# EAGLE design untitled (EAGLE 9.6.2)
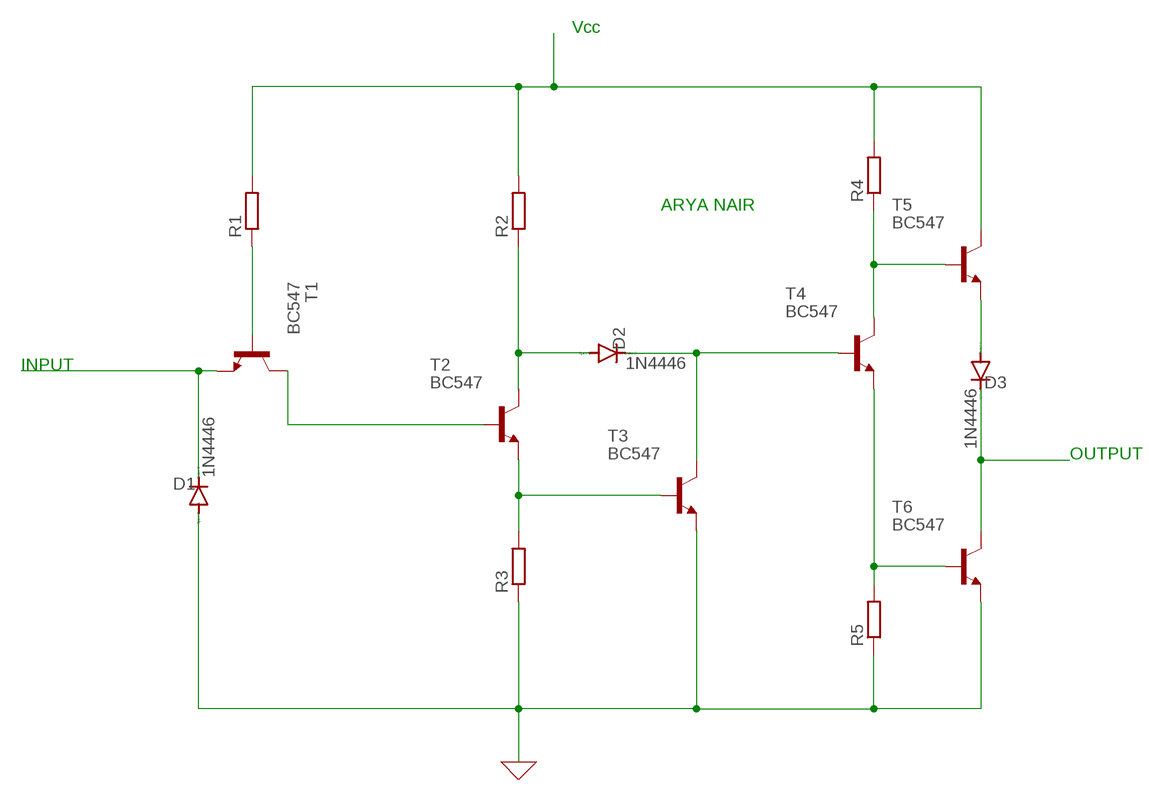
[diagram p0: schematic, sheet 1]

## Parts
D1  1N4446  [DO35-10]
D2  1N4446  [DO35-10]
D3  1N4446  [DO35-10]
R1  R-EU_0204/2V  [0204V]
R2  R-EU_0204/2V  [0204V]
R3  R-EU_0204/2V  [0204V]
R4  R-EU_0204/2V  [0204V]
R5  R-EU_0204/2V  [0204V]
T1  BC547  [TO92]
T2  BC547  [TO92]
T3  BC547  [TO92]
T4  BC547  [TO92]
T5  BC547  [TO92]
T6  BC547  [TO92]

## Nets
0: D1.A R3.1 R5.1 T3.1(E) T6.1(E) ; supply symbol labelled GND
N$1: T1.3(C) T2.2(B)
N$2: R3.2 T2.1(E) T3.2(B)
N$3: D2.A R2.1 T2.3(C)
N$4: R1.2 R2.2 R4.2 T5.3(C)
N$5: R1.1 T1.2(B)
N$7: D1.C T1.1(E)
N$8: D2.C T3.3(C) T4.2(B)
N$10: R4.1 T4.3(C) T5.2(B)
N$11: D3.A T5.1(E)
N$12: R5.2 T4.1(E) T6.2(B)
N$13: D3.C T6.3(C)

## Notes on the sheet
- Vcc
- ARYA NAIR
- INPUT
- OUTPUT

## Library data of the parts
D1-D3 = diode:1N4446: DIODE high speed (Philips)
R1-R5 = rcl:R-EU_: RESISTOR, European symbol; SPICEPREFIX: R
T1-T6 = transistor:BC547: NPN TRANSISTOR

## Board
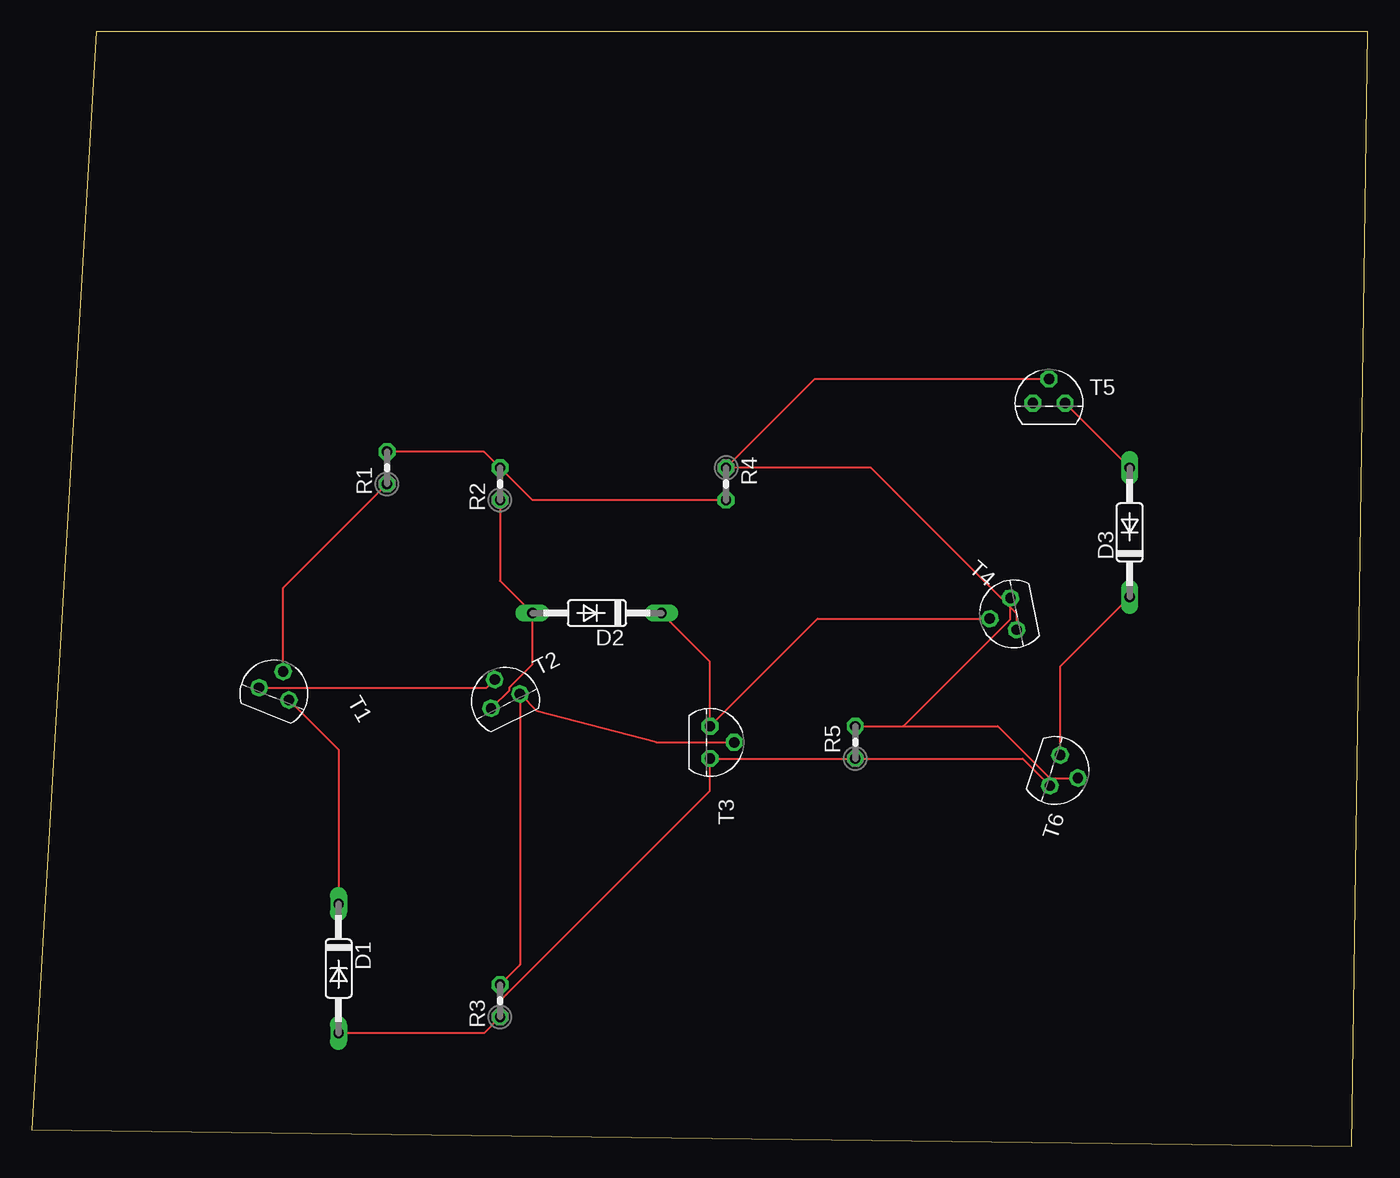
[diagram p1: board, top side]
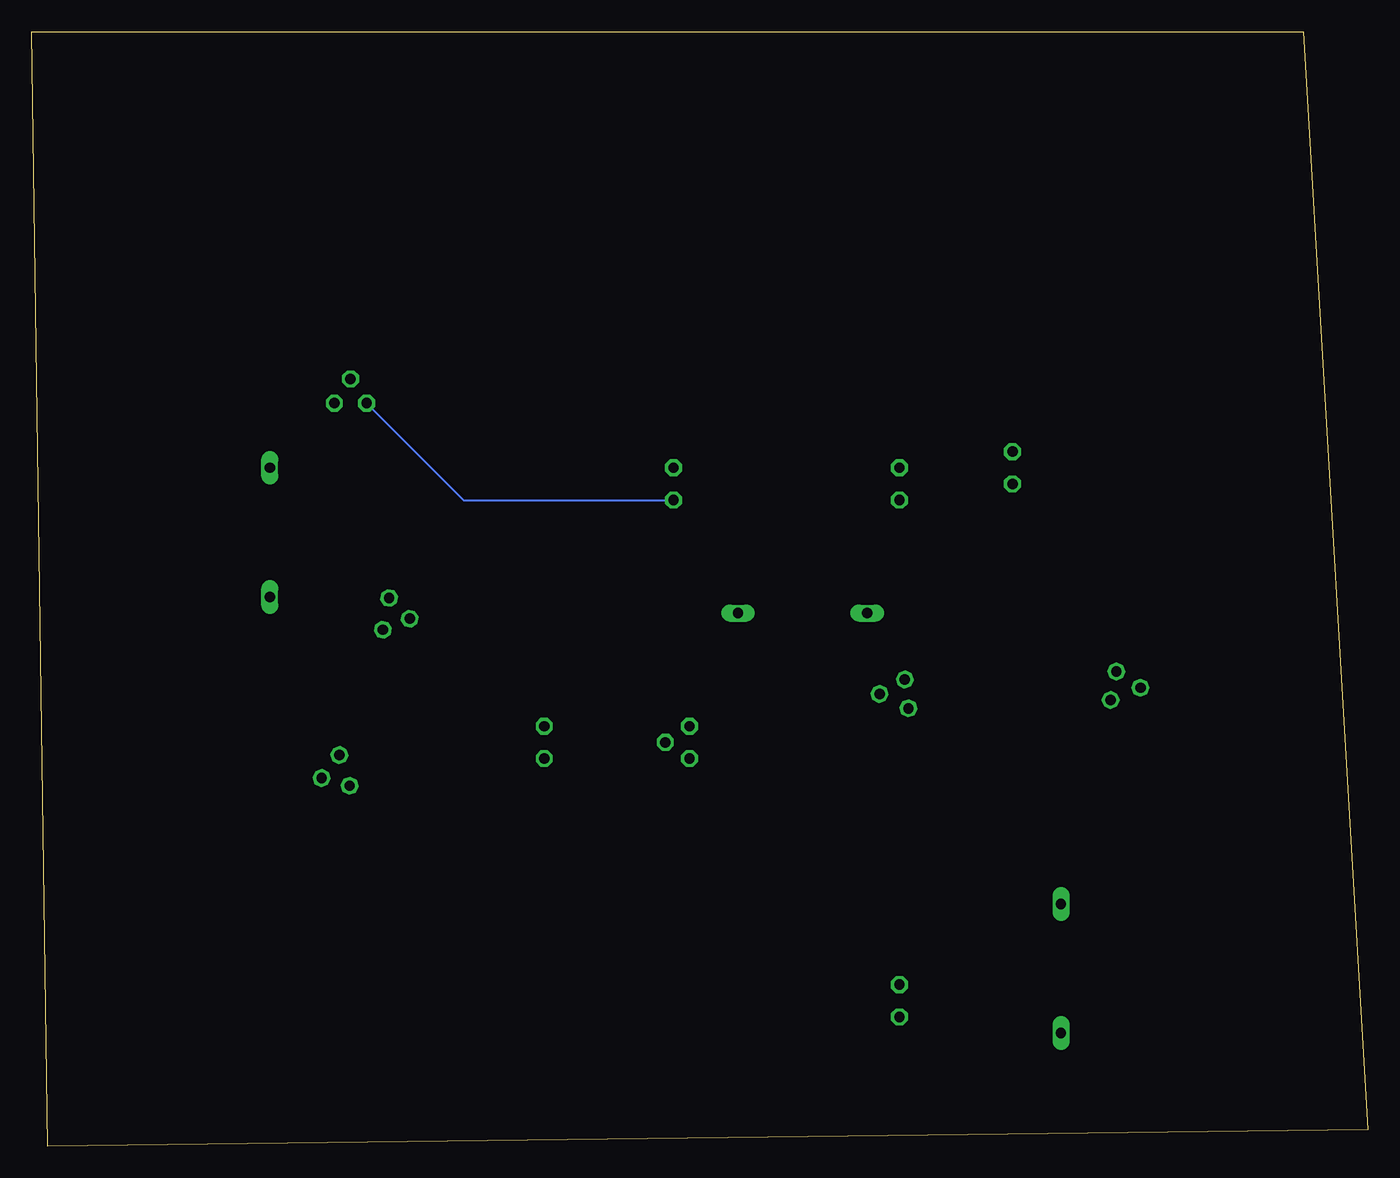
[diagram p2: board, bottom side, seen from below]

Size 105.08 x 87.62 mm. Coordinates in mm from the lower left corner, seen from the top.
Outline: 0,1.27 103.81,0 105.08,87.62 5.08,87.62 0,1.27
Copper layers (1*16): Top 0.035mm / dielectric 1.5mm / Bottom 0.035mm
Design rules "default": minimum track width 6mil, minimum drill 0.35mm, track to track 6mil, track to pad 6mil, pad to pad 6mil, via to via 6mil, smd to smd 6mil, copper to edge 40mil, drill to drill 6mil, minimum pad ring 10mil, minimum via ring 8mil, stop-mask expansion 4mil, vias tented up to drill 0mil, thermal gap 10mil

### Footprints (pad centres in the part's own frame; a part is rotated, then mirrored left to right if it is on the bottom)
DO35-10 = drill 0.813 long: A 5.08,0; C -5.08,0
0204V = drill 0.813 octagon: 1 -1.27,0; 2 1.27,0
TO92 = drill 0.813 octagon: 1 1.27,0; 2 0,1.905; 3 -1.27,0

### Placement (x,y rotation side)
D1  24.13,13.97 270 top
D2  44.45,41.91 180 top
D3  86.36,48.26 90 top
R1  27.94,53.34 90 top
R2  36.83,52.07 90 top
R3  36.83,11.43 90 top
R4  54.61,52.07 270 top
R5  64.77,31.75 90 top
T1  19.05,35.56 337.7 top
T2  37.26,34.99 26.5 top
T3  53.34,31.75 270 top
T4  77.22,41.85 101.3 top
T5  80.01,58.42 0 top
T6  80.48,29.55 251.5 top

### Tracks (layer width: path | path; a pad name or v marks a point on that pad's centre or on a via)
0
  Top 0.152: D1.A 35.56,8.89 R3.1 36.83,11.44 53.34,27.95 T3.1 R5.1 77.94,30.48 T6.1
N$1
  Top 0.152: T1.3 35.76,36.04 T2.2
N$2
  Top 0.152: R3.2 38.4,14.27 T2.1 39.75,34.21 49.13,31.75 T3.2
N$3
  Top 0.152: R2.1 36.83,44.45 D2.A 39.37,37.88 37.56,36.08 37.56,35.86 T2.3
N$4
  Top 0.152: R1.2 35.56,54.61 R2.2 39.37,50.8 R4.2
  Bottom 0.152: T5.3 71.12,50.8 R4.2
N$5
  Top 0.152: T1.2 19.77,43.9 R1.1
N$7
  Top 0.152: T1.1 24.13,31.17 D1.C
N$8
  Top 0.152: D2.C 53.34,38.1 T3.3 61.8,41.48 T4.2
N$10
  Top 0.152: T4.3 77.47,41.88 66.07,53.28 66.02,53.34 R4.1 61.59,60.33 T5.2
N$11
  Top 0.152: D3.A T5.1
N$12
  Top 0.152: T4.1 76.97,41.45 68.55,33.02 R5.2 75.99,33.02 80.06,28.94 T6.2
N$13
  Top 0.152: D3.C 80.88,37.7 T6.3